# Altium schematic sheet button_io.SchDoc
size A4
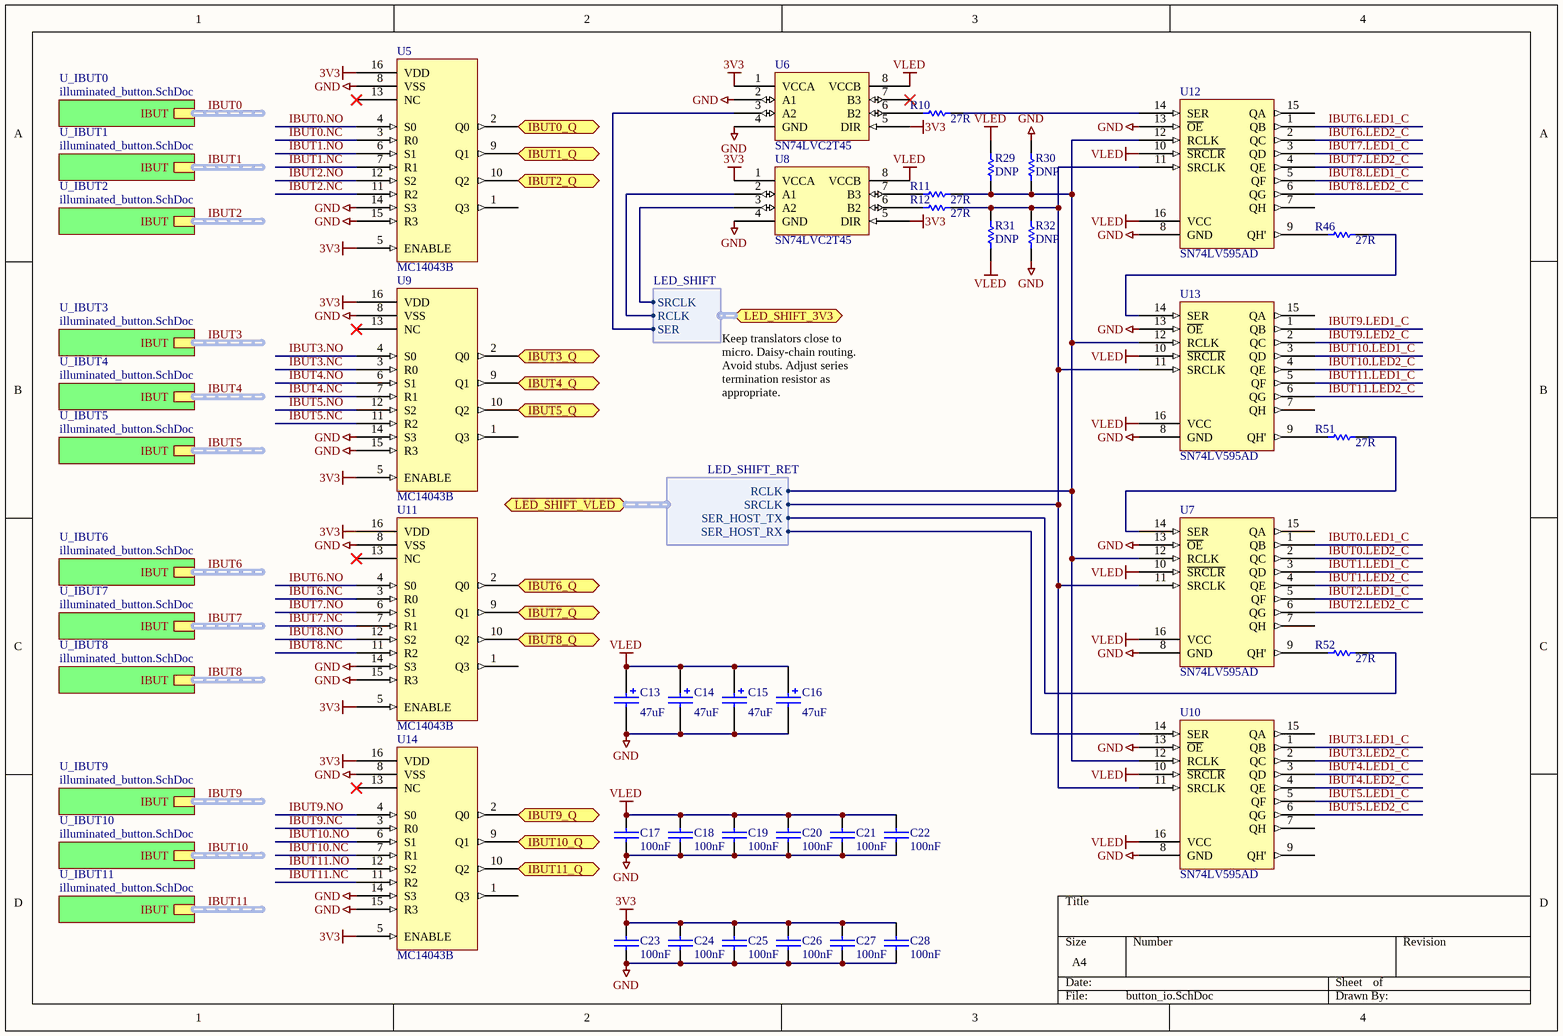
[diagram p0: button_io.SchDoc]

## Parts
C13  value 47uF  [CAPMP7343X19N (Murata D4)]
C14  value 47uF  [CAPMP7343X19N (Murata D4)]
C15  value 47uF  [CAPMP7343X19N (Murata D4)]
C16  value 47uF  [CAPMP7343X19N (Murata D4)]
C17  100nF  [0603]
C18  100nF  [0603]
C19  100nF  [0603]
C20  100nF  [0603]
C21  100nF  [0603]
C22  100nF  [0603]
C23  100nF  [0603]
C24  100nF  [0603]
C25  100nF  [0603]
C26  100nF  [0603]
C27  100nF  [0603]
C28  100nF  [0603]
R10  27R  [0603]
R11  27R  [0603]
R12  27R  [0603]
R29  DNP  [0603]
R30  DNP  [0603]
R31  DNP  [0603]
R32  DNP  [0603]
R46  27R  [0603]
R51  27R  [0603]
R52  27R  [0603]
U5  MC14043B  [SOIC127P600X175-16N]
U6  SN74LVC2T45  [TSOP65P400X130-8N]
U7  SN74LV595AD  [SOIC127P600X175-16N]
U8  SN74LVC2T45  [TSOP65P400X130-8N]
U9  MC14043B  [SOIC127P600X175-16N]
U10  SN74LV595AD  [SOIC127P600X175-16N]
U11  MC14043B  [SOIC127P600X175-16N]
U12  SN74LV595AD  [SOIC127P600X175-16N]
U13  SN74LV595AD  [SOIC127P600X175-16N]
U14  MC14043B  [SOIC127P600X175-16N]

## Sub-sheets
U_IBUT0 = illuminated_button.SchDoc: IBUT (harness IBUT)
U_IBUT1 = illuminated_button.SchDoc: IBUT (harness IBUT)
U_IBUT2 = illuminated_button.SchDoc: IBUT (harness IBUT)
U_IBUT3 = illuminated_button.SchDoc: IBUT (harness IBUT)
U_IBUT4 = illuminated_button.SchDoc: IBUT (harness IBUT)
U_IBUT5 = illuminated_button.SchDoc: IBUT (harness IBUT)
U_IBUT6 = illuminated_button.SchDoc: IBUT (harness IBUT)
U_IBUT7 = illuminated_button.SchDoc: IBUT (harness IBUT)
U_IBUT8 = illuminated_button.SchDoc: IBUT (harness IBUT)
U_IBUT9 = illuminated_button.SchDoc: IBUT (harness IBUT)
U_IBUT10 = illuminated_button.SchDoc: IBUT (harness IBUT)
U_IBUT11 = illuminated_button.SchDoc: IBUT (harness IBUT)

## Ports
IBUT0_Q (out), IBUT1_Q (out), IBUT2_Q (out), IBUT3_Q (out), IBUT4_Q (out), IBUT5_Q (out), IBUT6_Q (out), IBUT7_Q (out), IBUT8_Q (out), IBUT9_Q (out), IBUT10_Q (out), IBUT11_Q (out), LED_SHIFT_3V3 (harness LED_SHIFT), LED_SHIFT_VLED (harness LED_SHIFT_RET)

## Harnesses
LED_SHIFT: SER, RCLK, SRCLK
LED_SHIFT_RET: SER_HOST_TX, RCLK, SRCLK, SER_HOST_RX

## Nets
3V3: C23.1 C24.1 C25.1 C26.1 C27.1 C28.1 U5.5(ENABLE) U5.16(VDD) U6.1(VCCA) U6.5(DIR) U8.1(VCCA) U8.5(DIR) U9.5(ENABLE) U9.16(VDD) U11.5(ENABLE) U11.16(VDD) U14.5(ENABLE) U14.16(VDD)
GND: C13.2 C14.2 C15.2 C16.2 C17.2 C18.2 C19.2 C20.2 C21.2 C22.2 C23.2 C24.2 C25.2 C26.2 C27.2 C28.2 R30.1 R32.2 U5.8(VSS) U5.14(S3) U5.15(R3) U6.2(A1) U6.4(GND) U7.8(GND) U7.13(~{OE}) U8.4(GND) U9.8(VSS) U9.14(S3) U9.15(R3) U10.8(GND) U10.13(~{OE}) U11.8(VSS) U11.14(S3) U11.15(R3) U12.8(GND) U12.13(~{OE}) U13.8(GND) U13.13(~{OE}) U14.8(VSS) U14.14(S3) U14.15(R3)
VLED: C13.1 C14.1 C15.1 C16.1 C17.1 C18.1 C19.1 C20.1 C21.1 C22.1 R29.1 R31.2 U6.8(VCCB) U7.10(~{SRCLR}) U7.16(VCC) U8.8(VCCB) U10.10(~{SRCLR}) U10.16(VCC) U12.10(~{SRCLR}) U12.16(VCC) U13.10(~{SRCLR}) U13.16(VCC)
IBUT0.LED1_C: U7.1(QB)
IBUT0.LED2_C: U7.2(QC)
IBUT0.NC: U5.3(R0)
IBUT0.NO: U5.4(S0)
IBUT0_Q: U5.2(Q0) ; port IBUT0_Q
IBUT1.LED1_C: U7.3(QD)
IBUT1.LED2_C: U7.4(QE)
IBUT1.NC: U5.7(R1)
IBUT1.NO: U5.6(S1)
IBUT1_Q: U5.9(Q1) ; port IBUT1_Q
IBUT2.LED1_C: U7.5(QF)
IBUT2.LED2_C: U7.6(QG)
IBUT2.NC: U5.11(R2)
IBUT2.NO: U5.12(S2)
IBUT2_Q: U5.10(Q2) ; port IBUT2_Q
IBUT3.LED1_C: U10.1(QB)
IBUT3.LED2_C: U10.2(QC)
IBUT3.NC: U9.3(R0)
IBUT3.NO: U9.4(S0)
IBUT3_Q: U9.2(Q0) ; port IBUT3_Q
IBUT4.LED1_C: U10.3(QD)
IBUT4.LED2_C: U10.4(QE)
IBUT4.NC: U9.7(R1)
IBUT4.NO: U9.6(S1)
IBUT4_Q: U9.9(Q1) ; port IBUT4_Q
IBUT5.LED1_C: U10.5(QF)
IBUT5.LED2_C: U10.6(QG)
IBUT5.NC: U9.11(R2)
IBUT5.NO: U9.12(S2)
IBUT5_Q: U9.10(Q2) ; port IBUT5_Q
IBUT6.LED1_C: U12.1(QB)
IBUT6.LED2_C: U12.2(QC)
IBUT6.NC: U11.3(R0)
IBUT6.NO: U11.4(S0)
IBUT6_Q: U11.2(Q0) ; port IBUT6_Q
IBUT7.LED1_C: U12.3(QD)
IBUT7.LED2_C: U12.4(QE)
IBUT7.NC: U11.7(R1)
IBUT7.NO: U11.6(S1)
IBUT7_Q: U11.9(Q1) ; port IBUT7_Q
IBUT8.LED1_C: U12.5(QF)
IBUT8.LED2_C: U12.6(QG)
IBUT8.NC: U11.11(R2)
IBUT8.NO: U11.12(S2)
IBUT8_Q: U11.10(Q2) ; port IBUT8_Q
IBUT9.LED1_C: U13.1(QB)
IBUT9.LED2_C: U13.2(QC)
IBUT9.NC: U14.3(R0)
IBUT9.NO: U14.4(S0)
IBUT9_Q: U14.2(Q0) ; port IBUT9_Q
IBUT10.LED1_C: U13.3(QD)
IBUT10.LED2_C: U13.4(QE)
IBUT10.NC: U14.7(R1)
IBUT10.NO: U14.6(S1)
IBUT10_Q: U14.9(Q1) ; port IBUT10_Q
IBUT11.LED1_C: U13.5(QF)
IBUT11.LED2_C: U13.6(QG)
IBUT11.NC: U14.11(R2)
IBUT11.NO: U14.12(S2)
IBUT11_Q: U14.10(Q2) ; port IBUT11_Q
NetR10_1: R10.1 U12.14(SER)
NetR10_2: R10.2 U6.6(B2)
NetR11_1: R11.1 R29.2 R30.2 U7.12(RCLK) U10.12(RCLK) U12.12(RCLK) U13.12(RCLK) ; port LED_SHIFT_VLED.RCLK
NetR11_2: R11.2 U8.7(B3)
NetR12_1: R12.1 R31.1 R32.1 U7.11(SRCLK) U10.11(SRCLK) U12.11(SRCLK) U13.11(SRCLK) ; port LED_SHIFT_VLED.SRCLK
NetR12_2: R12.2 U8.6(B2)
NetR46_1: R46.1 U13.14(SER)
NetR46_2: R46.2 U12.9(QH')
NetR51_1: R51.1 U7.14(SER)
NetR51_2: R51.2 U13.9(QH')
NetR52_1: R52.1 ; port LED_SHIFT_VLED.SER_HOST_TX
NetR52_2: R52.2 U7.9(QH')
NetU6_3: U6.3(A2) ; port LED_SHIFT_3V3.SER
NetU8_2: U8.2(A1) ; port LED_SHIFT_3V3.RCLK
NetU8_3: U8.3(A2) ; port LED_SHIFT_3V3.SRCLK
NetU10_14: U10.14(SER) ; port LED_SHIFT_VLED.SER_HOST_RX

Not connected (* = marked no-connect by the designer): U5 1(Q3) 13(NC)*; U6 7(B3)*; U7 7(QH) 15(QA); U9 1(Q3) 13(NC)*; U10 7(QH) 9(QH') 15(QA); U11 1(Q3) 13(NC)*; U12 7(QH) 15(QA); U13 7(QH) 15(QA); U14 1(Q3) 13(NC)*

## Buses and harness runs
harness IBUT0 = sheet U_IBUT0/IBUT
harness IBUT1 = sheet U_IBUT1/IBUT
harness IBUT2 = sheet U_IBUT2/IBUT
harness IBUT3 = sheet U_IBUT3/IBUT
harness IBUT4 = sheet U_IBUT4/IBUT
harness IBUT5 = sheet U_IBUT5/IBUT
harness IBUT6 = sheet U_IBUT6/IBUT
harness IBUT7 = sheet U_IBUT7/IBUT
harness IBUT8 = sheet U_IBUT8/IBUT
harness IBUT9 = sheet U_IBUT9/IBUT
harness IBUT10 = sheet U_IBUT10/IBUT
harness IBUT11 = sheet U_IBUT11/IBUT

## Notes on the sheet
- Keep translators close to micro. Daisy-chain routing. Avoid stubs. Adjust series termination resistor as appropriate.
- (near C18) Text
- (near C24) Text

## Library data of the parts
C13-C16 = CAP POL3: Polarized Capacitor (Surface Mount); Manufacturer: Generic Components; Manufacturer Part Number: ECASD40J476M025K00; Class I: Passive; Description: CAP ALUM 47UF 6.3V 20% SMD; Capacitance: 47µF; Voltage Rating: 6.3V; Tolerance: ±20%; ESR (Equivalent Series Resistance): 25 mOhm; Lifetime @ Temp.: 1000 Hrs @ 105°C; Type: Polymer; Ripple Current: 1.8A; Surface Mount Land Size: 0.287" L x 0.169" W (7.30mm x 4.30mm); Published: 8-Jun-2000; Revision: July-2002: Re-released for DXP Platform.; Publisher: Altium Limited; Class II: Capacitor; Digikey: 490-5463-1-ND; Supplier 1: Digi-Key; Supplier Part Number 1: 490-5463-1-ND; RoHS: RoHS Compliant; Category: Capacitors; Stock 1: 3903; Pricing 1: 1=2.26, 10=1.848, 50=1.6224, 100=1.307, 250=1.0816, 500=0.96896, 1000=0.85628 (AUD); Packaging: Cut Tape (CT); Operating Temperature: -40°C ~ 105°C; Applications: -; Impedance: -; Lead Spacing: -; Size / Dimension: 0.287" L x 0.169" W (7.30mm x 4.30mm); Height - Seated (Max): 0.075" (1.90mm); Mounting Type: Surface Mount; Package / Case: 2917 (7343 Metric); ComponentLink1URL: http://www.murata.com/products/catalog/pdf/c90e.pdf; ComponentLink1Description: http://www.murata.com/products/catalog/pdf/c90e.pdf
C17-C28 = CAP: Capacitor; Manufacturer: TDK Corporation; Manufacturer Part Number: C1608X7R1H103K080AA; Needed?: NO - HW LAB; Description: CAP CER 10000PF 50V 10% X7R 0603; Capacitance: 10000pF; Voltage - Rated: 50V; Tolerance: ±10%; Temperature Coefficient: X7R; Value: 100nF; Supplier 1: Digi-Key; Supplier Part Number 1: 445-1311-1-ND; RoHS: RoHS Compliant; Category: Capacitors; Stock 1: 569844; Pricing 1: 1=0.14, 10=0.035, 100=0.0159, 250=0.01296, 500=0.0111, 1000=0.00865 (AUD); Packaging: Cut Tape (CT); Mounting Type: Surface Mount, MLCC; Operating Temperature: -55°C ~ 125°C; Applications: General Purpose; Ratings: -; Package / Case: 0603 (1608 Metric); Size / Dimension: 0.063" L x 0.031" W (1.60mm x 0.80mm); Height - Seated (Max): -; Thickness (Max): 0.037" (0.95mm); Lead Spacing: -; Features: -; Lead Style: -; ComponentLink1URL: http://product.tdk.com/capacitor/mlcc/en/documents/mlcc_commercial_general_en.pdf; ComponentLink1Description: http://product.tdk.com/capacitor/mlcc/en/documents/mlcc_commercial_general_en.pdf
R10-R12 R46 R51 R52 = Res Semi: Semiconductor Resistor; Manufacturer: Panasonic Electronic Components; Manufacturer Part Number: ERJ-3EKF27R0V; Value: 1K; Description: RES 27 OHM 1/10W 1% 0603 SMD; Resistance (Ohms): 27; Power (Watts): 0.1W, 1/10W; Temperature Coefficient: ±100ppm/°C; Tolerance: ±1%; Published: 8-Jun-2000; LatestRevisionDate: 17-Jul-2002; LatestRevisionNote: Re-released for DXP Platform.; PackageReference: AXIAL-0.5; Publisher: Altium Limited; PackageDescription: Axial Device, Thru-Hole; 2 Leads; 0.5 in Pin Spacing; Supplier 1: Digi-Key; Supplier Part Number 1: P27.0HCT-ND; RoHS: RoHS Compliant; Category: Resistors; Stock 1: 89523; Pricing 1: 1=0.12, 50=0.0166, 100=0.0126, 250=0.00936, 500=0.00692, 1000=0.00461 (AUD); Packaging: Cut Tape (CT); Composition: Thick Film; Features: -; Package / Case: 0603 (1608 Metric); Supplier Device Package: 0603; Size / Dimension: 0.063" L x 0.031" W (1.60mm x 0.80mm); Height: 0.022" (0.55mm); Number of Terminations: 2; ComponentLink1URL: http://industrial.panasonic.com/www-cgi/jvcr13pz.cgi?E+PZ+3+AOA0002+ERJ3EKF27R0V+7+WW; ComponentLink1Description: http://industrial.panasonic.com/www-cgi/jvcr13pz.cgi?E+PZ+3+AOA0002+ERJ3EKF27R0V+7+WW
R29-R32 = Res Semi: Semiconductor Resistor; Value: 1K; Published: 8-Jun-2000; LatestRevisionDate: 17-Jul-2002; LatestRevisionNote: Re-released for DXP Platform.; PackageReference: AXIAL-0.5; Publisher: Altium Limited; PackageDescription: Axial Device, Thru-Hole; 2 Leads; 0.5 in Pin Spacing
U5 U9 U11 U14 = MC14043B: Quad CMOS R-S Latches; Part Number: MC14043BDR2G; Manufacturer: ON Semiconductor; Description: IC LATCH R-S QUAD P/N 16-SOIC; Logic Type: S-R Latch; Circuit: 1:1; Output Type: Tri-State; Voltage - Supply: 3 V ~ 18 V; Independent Circuits: 4; Delay Time - Propagation: 60ns; Current - Output High, Low: 8.8mA, 8.8mA; Supplier 1: Digi-Key; Supplier Part Number 1: MC14043BDR2GOSCT-ND; Manufacturer Part Number: MC14043BDR2G; RoHS: RoHS Compliant; Category: Integrated Circuits (ICs); Stock 1: 3794; Pricing 1: 1=0.67, 10=0.57, 25=0.4988, 100=0.4271, 250=0.3704, 500=0.31374, 1000=0.24186 (AUD); Packaging: Cut Tape (CT); Operating Temperature: -55°C ~ 125°C; Mounting Type: Surface Mount; Package / Case: 16-SOIC (0.154", 3.90mm Width); Supplier Device Package: 16-SOIC; ComponentLink1URL: http://www.onsemi.com/pub_link/Collateral/MC14043B-D.PDF; ComponentLink1Description: http://www.onsemi.com/pub_link/Collateral/MC14043B-D.PDF
U6 U8 = SN74LVC2T45: Dual-bit  Dual-supply Bus Transceiver; Part Number: SN74LVC2T45DCT; Manufacturer: Texas Instruments; Manufacturer Part Number: SN74LVC2T45DCTR; Description: IC BUS TRANSCVR 2BIT N-INV SM8; Logic Function: Translator, Bidirectional, 3-State; Number of Bits: 2; Input Type: Logic; Data Rate: 420Mbps; Number of Outputs/Channel: 1; Differential - Input:Output: No/No; Propagation Delay (Max): 3.5ns; Voltage - Supply: 1.65 V ~ 5.5 V; Supplier 1: Digi-Key; Supplier Part Number 1: 296-16845-1-ND; RoHS: RoHS Compliant; Category: Integrated Circuits (ICs); Stock 1: 23612; Pricing 1: 1=0.89, 10=0.781, 25=0.6904, 100=0.6014, 250=0.52352, 500=0.44562, 1000=0.35693 (AUD); Packaging: Cut Tape (CT); Output Type: Logic; Number of Channels: 2; Operating Temperature: -40°C ~ 85°C; Package / Case: 8-LSSOP (0.11", 2.80mm Width); Supplier Device Package: SM8; ComponentLink1URL: http://www.ti.com/lit/ds/symlink/sn74lvc2t45.pdf; ComponentLink1Description: http://www.ti.com/lit/ds/symlink/sn74lvc2t45.pdf
U7 U10 U12 U13 = SN74LV595AD: 8-Bit Shift Registers with 3-State Output Registers; Manufacturer: Texas Instruments; Manufacturer Part Number: SN74LV595ADR; Description: IC 8-BIT SHFT REG TRI-ST 16-SOIC; Output Type: Tri-State; Number of Elements: 1; Number of Bits per Element: 8; Function: Serial to Parallel, Serial; Voltage - Supply: 2 V ~ 5.5 V; Supplier 1: Digi-Key; Supplier Part Number 1: 296-18747-1-ND; RoHS: RoHS Compliant; Category: Integrated Circuits (ICs); Stock 1: 11778; Pricing 1: 1=1.19, 10=1.041, 25=0.92, 100=0.8018, 250=0.698, 500=0.59416, 1000=0.47591 (AUD); Packaging: Cut Tape (CT); Logic Type: Shift Register; Operating Temperature: -40°C ~ 85°C; Mounting Type: Surface Mount; Package / Case: 16-SOIC (0.154", 3.90mm Width); Supplier Device Package: 16-SOIC N; ComponentLink1URL: http://www.ti.com/lit/ds/symlink/sn74lv595a.pdf; ComponentLink1Description: http://www.ti.com/lit/ds/symlink/sn74lv595a.pdf